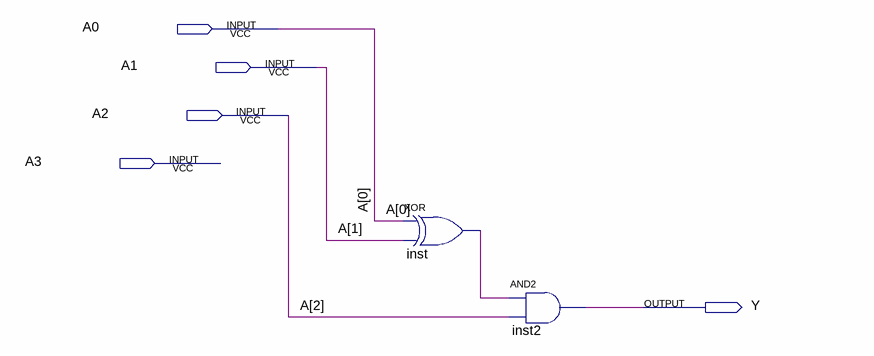
[diagram p0: schematic sheet]
// Quartus schematic Segment1.bdf as structural Verilog: 2 symbols, 5 pins
module Segment1 (
  input  A0,
  input  A1,
  input  A2,
  input  A3,
  output Y
);

  wire inst_out;

  xor inst (inst_out, A0, A1);
  and inst2 (Y, inst_out, A2);
endmodule
